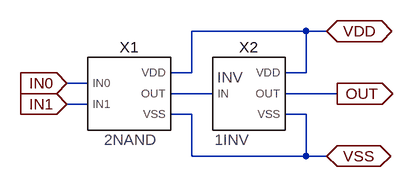
[diagram p0: schematic 2AND.asc]
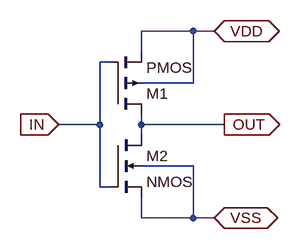
[diagram p1: sub-circuit 1inv.asc]
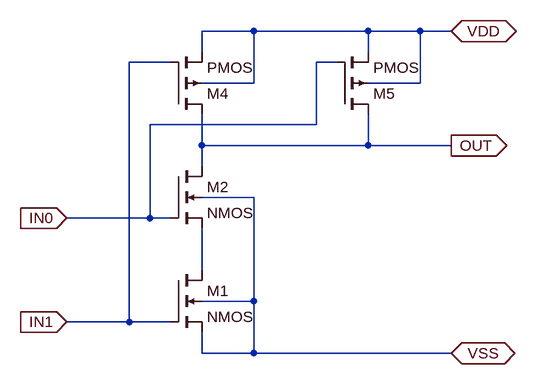
[diagram p2: sub-circuit 2nand.asc]
2AND.asc, the LTspice schematic file:
Version 4
SHEET 1 1048 680
WIRE 656 -32 480 -32
WIRE 688 -32 656 -32
WIRE 480 32 480 -32
WIRE 480 32 448 32
WIRE 656 32 656 -32
WIRE 656 32 624 32
WIRE 320 48 288 48
WIRE 512 64 448 64
WIRE 704 64 624 64
WIRE 320 80 288 80
WIRE 480 96 448 96
WIRE 656 96 624 96
WIRE 480 160 480 96
WIRE 656 160 656 96
WIRE 656 160 480 160
WIRE 688 160 656 160
FLAG 704 64 OUT
IOPIN 704 64 Out
FLAG 688 -32 VDD
IOPIN 688 -32 BiDir
FLAG 688 160 VSS
IOPIN 688 160 BiDir
FLAG 288 48 IN0
IOPIN 288 48 In
FLAG 288 80 IN1
IOPIN 288 80 In
SYMBOL 1INV 560 64 R0
SYMATTR InstName X2
SYMBOL 2NAND 384 64 R0
SYMATTR InstName X1

1inv.asc, the sub-circuit schematic file:
Version 4
SHEET 1 880 680
WIRE 224 -16 144 -16
WIRE 256 -16 224 -16
WIRE 144 16 144 -16
WIRE 96 32 80 32
WIRE 224 64 224 -16
WIRE 224 64 144 64
WIRE 80 128 80 32
WIRE 80 128 16 128
WIRE 144 128 144 112
WIRE 272 128 144 128
WIRE 144 144 144 128
WIRE 224 192 144 192
WIRE 80 224 80 128
WIRE 96 224 80 224
WIRE 144 272 144 240
WIRE 224 272 224 192
WIRE 224 272 144 272
WIRE 256 272 224 272
FLAG 16 128 IN
IOPIN 16 128 In
FLAG 272 128 OUT
IOPIN 272 128 Out
FLAG 256 -16 VDD
IOPIN 256 -16 BiDir
FLAG 256 272 VSS
IOPIN 256 272 BiDir
SYMBOL pmos4 96 112 M180
SYMATTR InstName M1
SYMATTR Value2 l=110nM w=180nM
SYMBOL nmos4 96 144 R0
SYMATTR InstName M2
SYMATTR Value2 l=110nM w=180nM

2nand.asc, the sub-circuit schematic file:
Version 4
SHEET 1 880 680
WIRE 224 -224 144 -224
WIRE 400 -224 224 -224
WIRE 480 -224 400 -224
WIRE 528 -224 480 -224
WIRE 144 -192 144 -224
WIRE 400 -192 400 -224
WIRE 96 -176 32 -176
WIRE 352 -176 320 -176
WIRE 224 -144 224 -224
WIRE 224 -144 144 -144
WIRE 480 -144 480 -224
WIRE 480 -144 400 -144
WIRE 320 -80 320 -176
WIRE 320 -80 64 -80
WIRE 144 -48 144 -96
WIRE 400 -48 400 -96
WIRE 400 -48 144 -48
WIRE 528 -48 400 -48
WIRE 144 -16 144 -48
WIRE 224 32 144 32
WIRE 64 64 64 -80
WIRE 64 64 -64 64
WIRE 96 64 64 64
WIRE 144 144 144 80
WIRE 224 192 224 32
WIRE 224 192 144 192
WIRE 32 224 32 -176
WIRE 32 224 -64 224
WIRE 96 224 32 224
WIRE 144 272 144 240
WIRE 224 272 224 192
WIRE 224 272 144 272
WIRE 528 272 224 272
FLAG 528 -224 VDD
IOPIN 528 -224 BiDir
FLAG 528 272 VSS
IOPIN 528 272 BiDir
FLAG -64 64 IN0
IOPIN -64 64 In
FLAG -64 224 IN1
IOPIN -64 224 In
FLAG 528 -48 OUT
IOPIN 528 -48 Out
SYMBOL nmos4 96 144 R0
SYMATTR InstName M1
SYMATTR Value2 l=110n w=180n
SYMBOL nmos4 96 -16 R0
SYMATTR InstName M2
SYMATTR Value2 l=110n w=180n
SYMBOL pmos4 96 -96 M180
SYMATTR InstName M4
SYMATTR Value2 l=110n w=180n
SYMBOL pmos4 352 -96 M180
SYMATTR InstName M5
SYMATTR Value2 l=110n w=180n

The netlist it stands for:
* 2AND.asc
XX2 N001 OUT VDD VSS 1inv
XX1 IN0 IN1 N001 VDD VSS 2nand

* block symbol definitions
.subckt 1inv IN OUT VDD VSS
M1 OUT IN VDD VDD PMOS l=110nM w=180nM
M2 OUT IN VSS VSS NMOS l=110nM w=180nM
.ends 1inv

.subckt 2nand IN0 IN1 OUT VDD VSS
M1 N001 IN1 VSS VSS NMOS l=110n w=180n
M2 OUT IN0 N001 VSS NMOS l=110n w=180n
M4 OUT IN1 VDD VDD PMOS l=110n w=180n
M5 OUT IN0 VDD VDD PMOS l=110n w=180n
.ends 2nand

.model NMOS NMOS
.model PMOS PMOS
.lib standard.mos
.backanno
.end